# EAGLE schematic untitled (EAGLE 9.3.0)
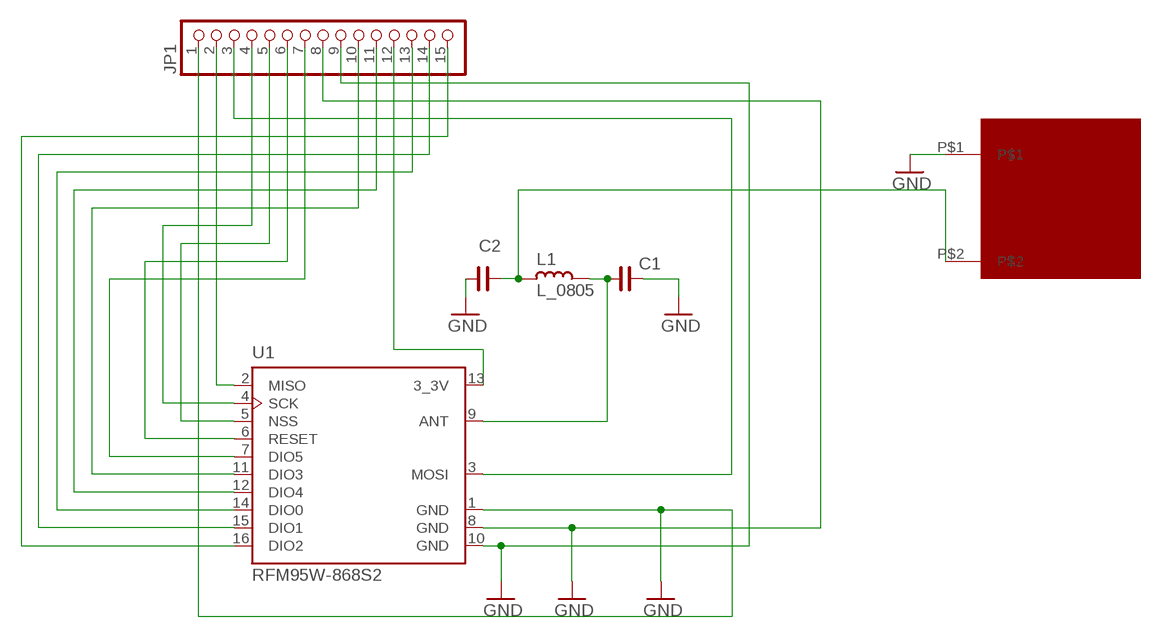
[diagram p0: schematic, sheet 1]

## Parts
C1  C_0805  [C0805]
C2  C_0805  [C0805]
JP1  PINHD-1X15  [1X15]
L1  L_0805  [L0805]
U1  RFM95W-868S2  [XCVR_RFM95W-868S2]
U$1  868  [868]

## Nets
GND: C1.2 C2.1 JP1.1 JP1.8 JP1.9 U1.1(GND) U1.8(GND) U1.10(GND) U$1.P$1
N$1: C2.2 L1.2 U$1.P$2
N$2: C1.1 L1.1 U1.9(ANT)
N$17: JP1.2 U1.2(MISO)
N$18: JP1.3 U1.3(MOSI)
N$19: JP1.4 U1.4(SCK)
N$20: JP1.5 U1.5(NSS)
N$21: JP1.6 U1.6(RESET)
N$22: JP1.7 U1.7(DIO5)
N$25: JP1.10 U1.11(DIO3)
N$26: JP1.11 U1.12(DIO4)
N$27: JP1.12 U1.13(3_3V)
N$28: JP1.13 U1.14(DIO0)
N$29: JP1.14 U1.15(DIO1)
N$30: JP1.15 U1.16(DIO2)

## Library data of the parts
C1 C2 = rc-master-smd:C_: NON-POLARIZED CAP
JP1 = pinhead:PINHD-1X15: PIN HEADER
L1 = rc-master-smd:L_: INDUCTOR
U1 = RFM95W-868S2:RFM95W-868S2: Mod Txrx Lora +20dbm 868mhz Smd; AVAILABILITY: Unavailable; DESCRIPTION: General ISM < 1GHz LoRa™ Transceiver Module 868MHz Antenna Not Included Surface Mount; MF: RF; MP: RFM95W-868S2; PACKAGE: SMD-16 Hope Microelectronics; PRICE: None
U$1 = 868:868